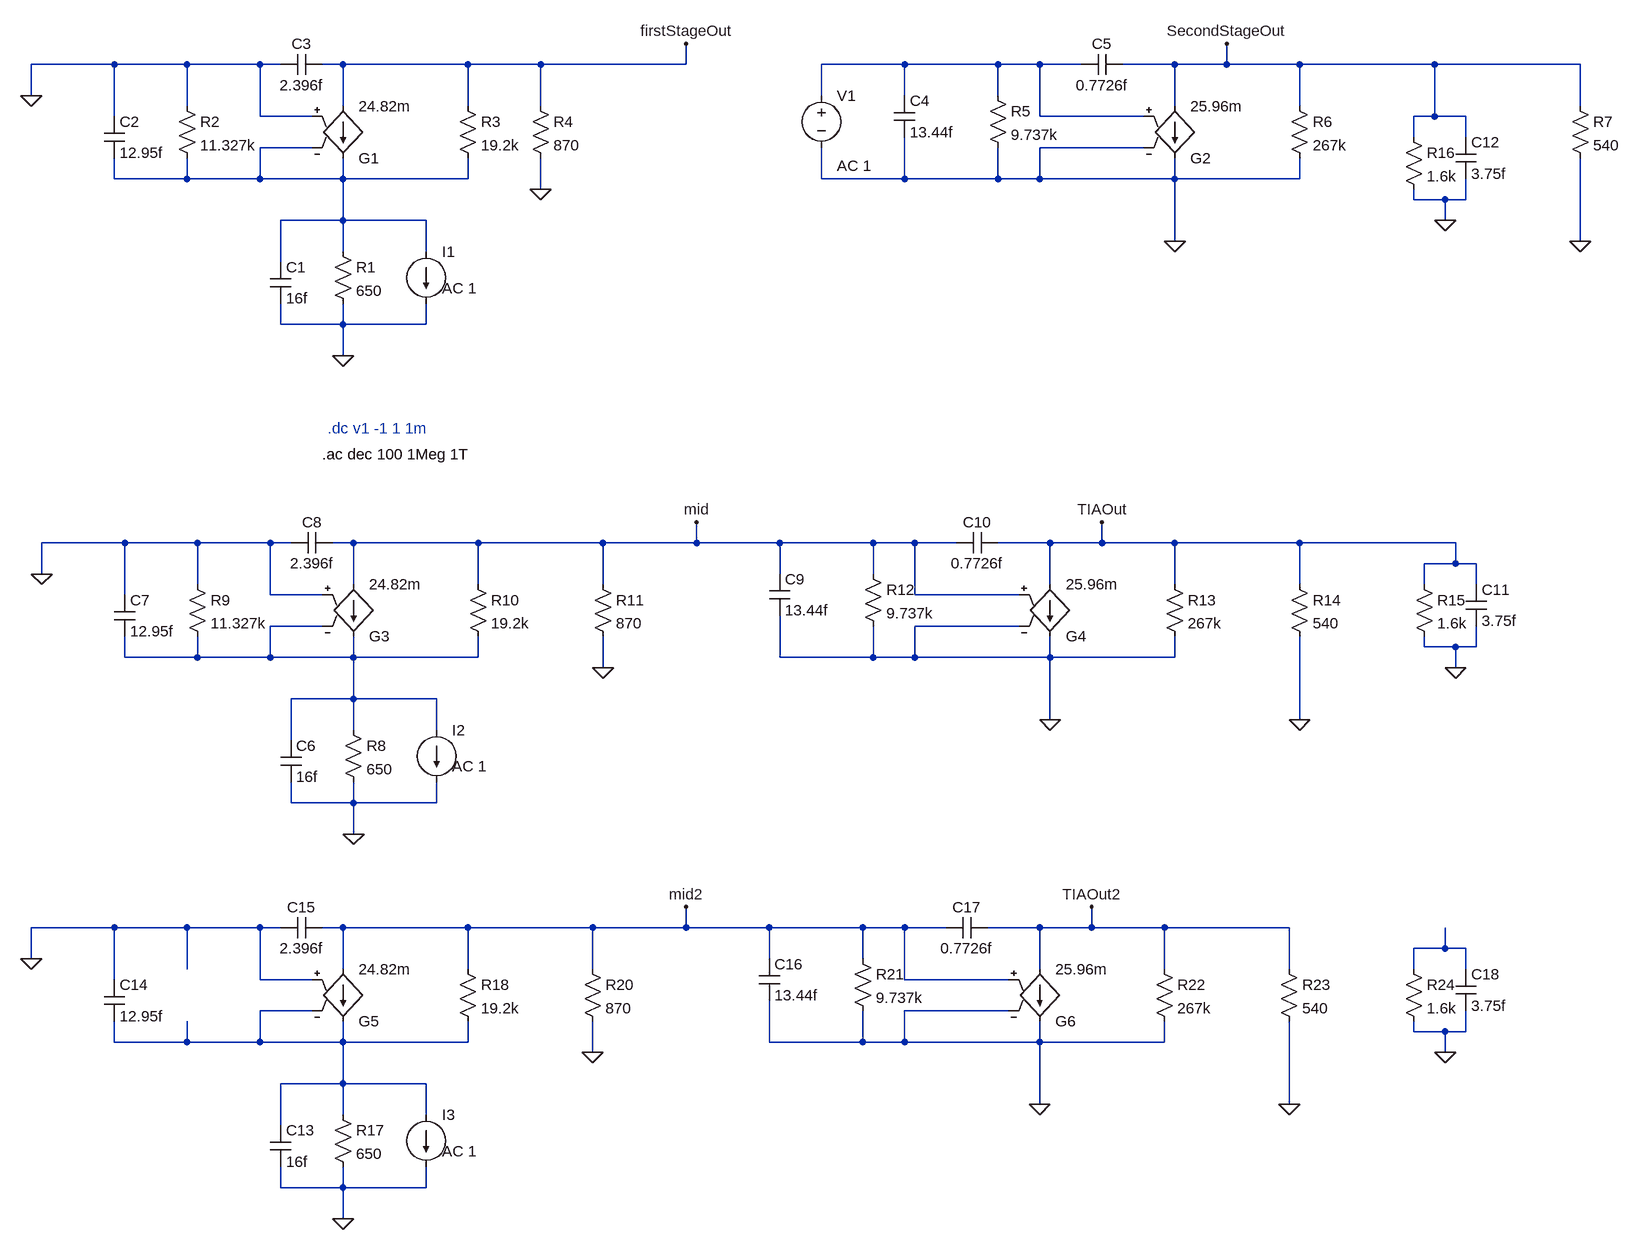
[diagram p0: schematic TIASubCont.asc]
TIASubCont.asc, the LTspice schematic file:
Version 4
SHEET 1 2052 1812
WIRE -272 16 -400 16
WIRE -160 16 -272 16
WIRE -48 16 -160 16
WIRE -16 16 -48 16
WIRE 80 16 48 16
WIRE 272 16 80 16
WIRE 384 16 272 16
WIRE 608 16 608 -16
WIRE 608 16 384 16
WIRE 944 16 816 16
WIRE 1088 16 944 16
WIRE 1152 16 1088 16
WIRE 1216 16 1152 16
WIRE 1360 16 1280 16
WIRE 1440 16 1440 -16
WIRE 1440 16 1360 16
WIRE 1552 16 1440 16
WIRE 1760 16 1552 16
WIRE 1984 16 1760 16
WIRE -400 64 -400 16
WIRE 816 64 816 16
WIRE 944 64 944 16
WIRE 1088 64 1088 16
WIRE -160 80 -160 16
WIRE 80 80 80 16
WIRE 272 80 272 16
WIRE 384 80 384 16
WIRE 1360 80 1360 16
WIRE 1552 80 1552 16
WIRE 1984 80 1984 16
WIRE -272 96 -272 16
WIRE -48 96 -48 16
WIRE 32 96 -48 96
WIRE 1152 96 1152 16
WIRE 1312 96 1152 96
WIRE 1760 96 1760 16
WIRE 1760 96 1728 96
WIRE 1808 96 1760 96
WIRE 1728 128 1728 96
WIRE 1808 128 1808 96
WIRE 32 144 -48 144
WIRE 1312 144 1152 144
WIRE -272 192 -272 160
WIRE -160 192 -160 160
WIRE -160 192 -272 192
WIRE -48 192 -48 144
WIRE -48 192 -160 192
WIRE 80 192 80 160
WIRE 80 192 -48 192
WIRE 272 192 272 160
WIRE 272 192 80 192
WIRE 816 192 816 144
WIRE 944 192 944 128
WIRE 944 192 816 192
WIRE 1088 192 1088 144
WIRE 1088 192 944 192
WIRE 1152 192 1152 144
WIRE 1152 192 1088 192
WIRE 1360 192 1360 160
WIRE 1360 192 1152 192
WIRE 1552 192 1552 160
WIRE 1552 192 1360 192
WIRE 384 208 384 160
WIRE 1728 224 1728 208
WIRE 1776 224 1728 224
WIRE 1808 224 1808 192
WIRE 1808 224 1776 224
WIRE 80 256 80 192
WIRE 80 256 -16 256
WIRE 208 256 80 256
WIRE 1776 256 1776 224
WIRE 1360 288 1360 192
WIRE 1984 288 1984 160
WIRE 80 304 80 256
WIRE 208 304 208 256
WIRE -16 320 -16 256
WIRE -16 416 -16 384
WIRE 80 416 80 384
WIRE 80 416 -16 416
WIRE 208 416 208 384
WIRE 208 416 80 416
WIRE 80 464 80 416
WIRE -256 752 -384 752
WIRE -144 752 -256 752
WIRE -32 752 -144 752
WIRE 0 752 -32 752
WIRE 96 752 64 752
WIRE 288 752 96 752
WIRE 480 752 288 752
WIRE 624 752 624 720
WIRE 624 752 480 752
WIRE 752 752 624 752
WIRE 896 752 752 752
WIRE 960 752 896 752
WIRE 1024 752 960 752
WIRE 1168 752 1088 752
WIRE 1248 752 1248 720
WIRE 1248 752 1168 752
WIRE 1360 752 1248 752
WIRE 1552 752 1360 752
WIRE 1792 752 1552 752
WIRE 1792 784 1792 752
WIRE 1792 784 1744 784
WIRE 1824 784 1792 784
WIRE -384 800 -384 752
WIRE 752 800 752 752
WIRE 896 800 896 752
WIRE -144 816 -144 752
WIRE 96 816 96 752
WIRE 288 816 288 752
WIRE 480 816 480 752
WIRE 1168 816 1168 752
WIRE 1360 816 1360 752
WIRE 1552 816 1552 752
WIRE 1744 816 1744 784
WIRE 1824 816 1824 784
WIRE -256 832 -256 752
WIRE -32 832 -32 752
WIRE 48 832 -32 832
WIRE 960 832 960 752
WIRE 1120 832 960 832
WIRE 48 880 -32 880
WIRE 1120 880 960 880
WIRE 1744 912 1744 896
WIRE 1792 912 1744 912
WIRE 1824 912 1824 880
WIRE 1824 912 1792 912
WIRE -256 928 -256 896
WIRE -144 928 -144 896
WIRE -144 928 -256 928
WIRE -32 928 -32 880
WIRE -32 928 -144 928
WIRE 96 928 96 896
WIRE 96 928 -32 928
WIRE 288 928 288 896
WIRE 288 928 96 928
WIRE 752 928 752 864
WIRE 896 928 896 880
WIRE 896 928 752 928
WIRE 960 928 960 880
WIRE 960 928 896 928
WIRE 1168 928 1168 896
WIRE 1168 928 960 928
WIRE 1360 928 1360 896
WIRE 1360 928 1168 928
WIRE 480 944 480 896
WIRE 1792 944 1792 912
WIRE 96 992 96 928
WIRE 96 992 0 992
WIRE 224 992 96 992
WIRE 1168 1024 1168 928
WIRE 1552 1024 1552 896
WIRE 96 1040 96 992
WIRE 224 1040 224 992
WIRE 0 1056 0 992
WIRE 0 1152 0 1120
WIRE 96 1152 96 1120
WIRE 96 1152 0 1152
WIRE 224 1152 224 1120
WIRE 224 1152 96 1152
WIRE 96 1200 96 1152
WIRE -272 1344 -400 1344
WIRE -160 1344 -272 1344
WIRE -48 1344 -160 1344
WIRE -16 1344 -48 1344
WIRE 80 1344 48 1344
WIRE 272 1344 80 1344
WIRE 464 1344 272 1344
WIRE 608 1344 608 1312
WIRE 608 1344 464 1344
WIRE 736 1344 608 1344
WIRE 880 1344 736 1344
WIRE 944 1344 880 1344
WIRE 1008 1344 944 1344
WIRE 1152 1344 1072 1344
WIRE 1232 1344 1232 1312
WIRE 1232 1344 1152 1344
WIRE 1344 1344 1232 1344
WIRE 1536 1344 1344 1344
WIRE 1776 1376 1776 1344
WIRE 1776 1376 1728 1376
WIRE 1808 1376 1776 1376
WIRE -400 1392 -400 1344
WIRE 736 1392 736 1344
WIRE 880 1392 880 1344
WIRE -160 1408 -160 1344
WIRE 80 1408 80 1344
WIRE 272 1408 272 1344
WIRE 464 1408 464 1344
WIRE 1152 1408 1152 1344
WIRE 1344 1408 1344 1344
WIRE 1536 1408 1536 1344
WIRE 1728 1408 1728 1376
WIRE 1808 1408 1808 1376
WIRE -272 1424 -272 1344
WIRE -48 1424 -48 1344
WIRE 32 1424 -48 1424
WIRE 944 1424 944 1344
WIRE 1104 1424 944 1424
WIRE 32 1472 -48 1472
WIRE 1104 1472 944 1472
WIRE 1728 1504 1728 1488
WIRE 1776 1504 1728 1504
WIRE 1808 1504 1808 1472
WIRE 1808 1504 1776 1504
WIRE -272 1520 -272 1488
WIRE -160 1520 -160 1488
WIRE -160 1520 -272 1520
WIRE -48 1520 -48 1472
WIRE -48 1520 -160 1520
WIRE 80 1520 80 1488
WIRE 80 1520 -48 1520
WIRE 272 1520 272 1488
WIRE 272 1520 80 1520
WIRE 736 1520 736 1456
WIRE 880 1520 880 1472
WIRE 880 1520 736 1520
WIRE 944 1520 944 1472
WIRE 944 1520 880 1520
WIRE 1152 1520 1152 1488
WIRE 1152 1520 944 1520
WIRE 1344 1520 1344 1488
WIRE 1344 1520 1152 1520
WIRE 464 1536 464 1488
WIRE 1776 1536 1776 1504
WIRE 80 1584 80 1520
WIRE 80 1584 -16 1584
WIRE 208 1584 80 1584
WIRE 1152 1616 1152 1520
WIRE 1536 1616 1536 1488
WIRE 80 1632 80 1584
WIRE 208 1632 208 1584
WIRE -16 1648 -16 1584
WIRE -16 1744 -16 1712
WIRE 80 1744 80 1712
WIRE 80 1744 -16 1744
WIRE 208 1744 208 1712
WIRE 208 1744 80 1744
WIRE 80 1792 80 1744
FLAG 80 464 0
FLAG -400 64 0
FLAG 384 208 0
FLAG 1360 288 0
FLAG 1984 288 0
FLAG 608 -16 firstStageOut
FLAG 1440 -16 SecondStageOut
FLAG -384 800 0
FLAG 480 944 0
FLAG 1168 1024 0
FLAG 1552 1024 0
FLAG 624 720 mid
FLAG 1248 720 TIAOut
FLAG 96 1200 0
FLAG 1792 944 0
FLAG 1776 256 0
FLAG -400 1392 0
FLAG 464 1536 0
FLAG 1152 1616 0
FLAG 1536 1616 0
FLAG 608 1312 mid2
FLAG 1232 1312 TIAOut2
FLAG 80 1792 0
FLAG 1776 1536 0
SYMBOL current 208 304 R0
WINDOW 123 24 56 Left 2
WINDOW 39 0 0 Left 0
WINDOW 3 24 28 Left 2
SYMATTR Value2 AC 1
SYMATTR Value ""
SYMATTR InstName I1
SYMBOL g2 80 176 M180
SYMATTR InstName G1
SYMATTR Value 24.82m
SYMBOL res 64 288 R0
SYMATTR InstName R1
SYMATTR Value 650
SYMBOL cap -32 320 R0
SYMATTR InstName C1
SYMATTR Value 16f
SYMBOL res -176 64 R0
SYMATTR InstName R2
SYMATTR Value 11.327k
SYMBOL res 256 64 R0
SYMATTR InstName R3
SYMATTR Value 19.2k
SYMBOL res 368 64 R0
SYMATTR InstName R4
SYMATTR Value 870
SYMBOL cap -288 96 R0
SYMATTR InstName C2
SYMATTR Value 12.95f
SYMBOL cap 48 0 R90
WINDOW 0 0 32 VBottom 2
WINDOW 3 32 32 VTop 2
SYMATTR InstName C3
SYMATTR Value 2.396f
SYMBOL cap 928 64 R0
SYMATTR InstName C4
SYMATTR Value 13.44f
SYMBOL cap 1280 0 R90
WINDOW 0 0 32 VBottom 2
WINDOW 3 32 32 VTop 2
SYMATTR InstName C5
SYMATTR Value 0.7726f
SYMBOL res 1072 48 R0
SYMATTR InstName R5
SYMATTR Value 9.737k
SYMBOL res 1536 64 R0
SYMATTR InstName R6
SYMATTR Value 267k
SYMBOL res 1968 64 R0
SYMATTR InstName R7
SYMATTR Value 540
SYMBOL g2 1360 176 M180
SYMATTR InstName G2
SYMATTR Value 25.96m
SYMBOL voltage 816 48 R0
WINDOW 123 24 124 Left 2
WINDOW 39 0 0 Left 0
SYMATTR Value2 AC 1
SYMATTR InstName V1
SYMATTR Value ""
SYMBOL current 224 1040 R0
WINDOW 123 24 56 Left 2
WINDOW 39 0 0 Left 0
WINDOW 3 24 28 Left 2
SYMATTR Value2 AC 1
SYMATTR Value ""
SYMATTR InstName I2
SYMBOL g2 96 912 M180
SYMATTR InstName G3
SYMATTR Value 24.82m
SYMBOL res 80 1024 R0
SYMATTR InstName R8
SYMATTR Value 650
SYMBOL cap -16 1056 R0
SYMATTR InstName C6
SYMATTR Value 16f
SYMBOL res -160 800 R0
SYMATTR InstName R9
SYMATTR Value 11.327k
SYMBOL res 272 800 R0
SYMATTR InstName R10
SYMATTR Value 19.2k
SYMBOL res 464 800 R0
SYMATTR InstName R11
SYMATTR Value 870
SYMBOL cap -272 832 R0
SYMATTR InstName C7
SYMATTR Value 12.95f
SYMBOL cap 64 736 R90
WINDOW 0 0 32 VBottom 2
WINDOW 3 32 32 VTop 2
SYMATTR InstName C8
SYMATTR Value 2.396f
SYMBOL cap 736 800 R0
SYMATTR InstName C9
SYMATTR Value 13.44f
SYMBOL cap 1088 736 R90
WINDOW 0 0 32 VBottom 2
WINDOW 3 32 32 VTop 2
SYMATTR InstName C10
SYMATTR Value 0.7726f
SYMBOL res 880 784 R0
SYMATTR InstName R12
SYMATTR Value 9.737k
SYMBOL res 1344 800 R0
SYMATTR InstName R13
SYMATTR Value 267k
SYMBOL res 1536 800 R0
SYMATTR InstName R14
SYMATTR Value 540
SYMBOL g2 1168 912 M180
SYMATTR InstName G4
SYMATTR Value 25.96m
SYMBOL res 1728 800 R0
SYMATTR InstName R15
SYMATTR Value 1.6k
SYMBOL cap 1808 816 R0
SYMATTR InstName C11
SYMATTR Value 3.75f
SYMBOL res 1712 112 R0
SYMATTR InstName R16
SYMATTR Value 1.6k
SYMBOL cap 1792 128 R0
SYMATTR InstName C12
SYMATTR Value 3.75f
SYMBOL current 208 1632 R0
WINDOW 123 24 56 Left 2
WINDOW 39 0 0 Left 0
WINDOW 3 24 28 Left 2
SYMATTR Value2 AC 1
SYMATTR Value ""
SYMATTR InstName I3
SYMBOL g2 80 1504 M180
SYMATTR InstName G5
SYMATTR Value 24.82m
SYMBOL res 64 1616 R0
SYMATTR InstName R17
SYMATTR Value 650
SYMBOL cap -32 1648 R0
SYMATTR InstName C13
SYMATTR Value 16f
SYMBOL res 448 1392 R0
SYMATTR InstName R20
SYMATTR Value 870
SYMBOL cap 720 1392 R0
SYMATTR InstName C16
SYMATTR Value 13.44f
SYMBOL cap 1072 1328 R90
WINDOW 0 0 32 VBottom 2
WINDOW 3 32 32 VTop 2
SYMATTR InstName C17
SYMATTR Value 0.7726f
SYMBOL res 864 1376 R0
SYMATTR InstName R21
SYMATTR Value 9.737k
SYMBOL res 1328 1392 R0
SYMATTR InstName R22
SYMATTR Value 267k
SYMBOL res 1520 1392 R0
SYMATTR InstName R23
SYMATTR Value 540
SYMBOL g2 1152 1504 M180
SYMATTR InstName G6
SYMATTR Value 25.96m
SYMBOL res 1712 1392 R0
SYMATTR InstName R24
SYMATTR Value 1.6k
SYMBOL cap 1792 1408 R0
SYMATTR InstName C18
SYMATTR Value 3.75f
SYMBOL res 256 1392 R0
SYMATTR InstName R18
SYMATTR Value 19.2k
SYMBOL cap -288 1424 R0
SYMATTR InstName C14
SYMATTR Value 12.95f
SYMBOL cap 48 1328 R90
WINDOW 0 0 32 VBottom 2
WINDOW 3 32 32 VTop 2
SYMATTR InstName C15
SYMATTR Value 2.396f
TEXT 48 616 Left 2 !.ac dec 100 1Meg 1T
TEXT 56 576 Left 2 ;.dc v1 -1 1 1m

The netlist it stands for:
* TIASubCont.asc
I1 N002 0 AC 1
G1 firstStageOut N002 0 N002 24.82m
R1 N002 0 650
C1 N002 0 16f
R2 0 N002 11.327k
R3 firstStageOut N002 19.2k
R4 firstStageOut 0 870
C2 0 N002 12.95f
C3 firstStageOut 0 2.396f
C4 N001 0 13.44f
C5 SecondStageOut N001 0.7726f
R5 N001 0 9.737k
R6 SecondStageOut 0 267k
R7 SecondStageOut 0 540
G2 SecondStageOut 0 N001 0 25.96m
V1 N001 0 AC 1
I2 N003 0 AC 1
G3 mid N003 0 N003 24.82m
R8 N003 0 650
C6 N003 0 16f
R9 0 N003 11.327k
R10 mid N003 19.2k
R11 mid 0 870
C7 0 N003 12.95f
C8 mid 0 2.396f
C9 mid 0 13.44f
C10 TIAOut mid 0.7726f
R12 mid 0 9.737k
R13 TIAOut 0 267k
R14 TIAOut 0 540
G4 TIAOut 0 mid 0 25.96m
R15 TIAOut 0 1.6k
C11 TIAOut 0 3.75f
R16 SecondStageOut 0 1.6k
C12 SecondStageOut 0 3.75f
I3 N005 0 AC 1
G5 mid2 N005 0 N005 24.82m
R17 N005 0 650
C13 N005 0 16f
R20 mid2 0 870
C16 mid2 0 13.44f
C17 TIAOut2 mid2 0.7726f
R21 mid2 0 9.737k
R22 TIAOut2 0 267k
R23 TIAOut2 0 540
G6 TIAOut2 0 mid2 0 25.96m
R24 N004 0 1.6k
C18 N004 0 3.75f
R18 mid2 N005 19.2k
C14 0 N005 12.95f
C15 mid2 0 2.396f
.ac dec 100 1Meg 1T
* .dc v1 -1 1 1m
.backanno
.end